# EAGLE design as5600 (EAGLE 9.6.2)
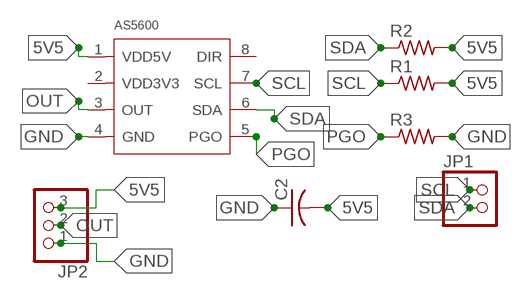
[diagram p0: schematic, sheet 1]

## Parts
AS5600  AS5600AS5600  [AS5600]
C2  C-USC0603  [C0603]
JP1  PINHD-1X2  [1X02]
JP2  PINHD-1X3  [1X03]
R1  R-US_R0603  [R0603]
R2  R-US_R0603  [R0603]
R3  R-US_R0603  [R0603]

## Nets
5V5: AS5600.1(VDD5V) C2.2 JP2.3 R1.2 R2.2
GND: AS5600.4(GND) C2.1 JP2.1 R3.2
OUT: AS5600.3(OUT) JP2.2
PGO: AS5600.5(PGO) R3.1
SCL: AS5600.7(SCL) JP1.1 R1.1
SDA: AS5600.6(SDA) JP1.2 R2.1
Unconnected: AS5600.2(VDD3V3) AS5600.8(DIR)

## Library data of the parts
AS5600 = AS5600:AS5600: AS5600 12-Bit Programmable Contactless Potentiometer Check availability <https://pricing.snapeda.com/parts/AS5600/Ams%20AG/view-part?ref=eda>; AVAILABILITY: In Stock; DESCRIPTION: Hall Effect Sensor Rotary Position External Magnet, Not Included Gull Wing; MF: Ams AG; MP: AS5600; PACKAGE: None; PRICE: None; PURCHASE-URL: https://pricing.snapeda.com/search/part/AS5600/?ref=eda
C2 = rcl:C-US: CAPACITOR, American symbol; SPICEPREFIX: C
JP1 = pinhead:PINHD-1X2: PIN HEADER
JP2 = pinhead:PINHD-1X3: PIN HEADER
R1-R3 = rcl:R-US_: RESISTOR, American symbol; SPICEPREFIX: R

## Board
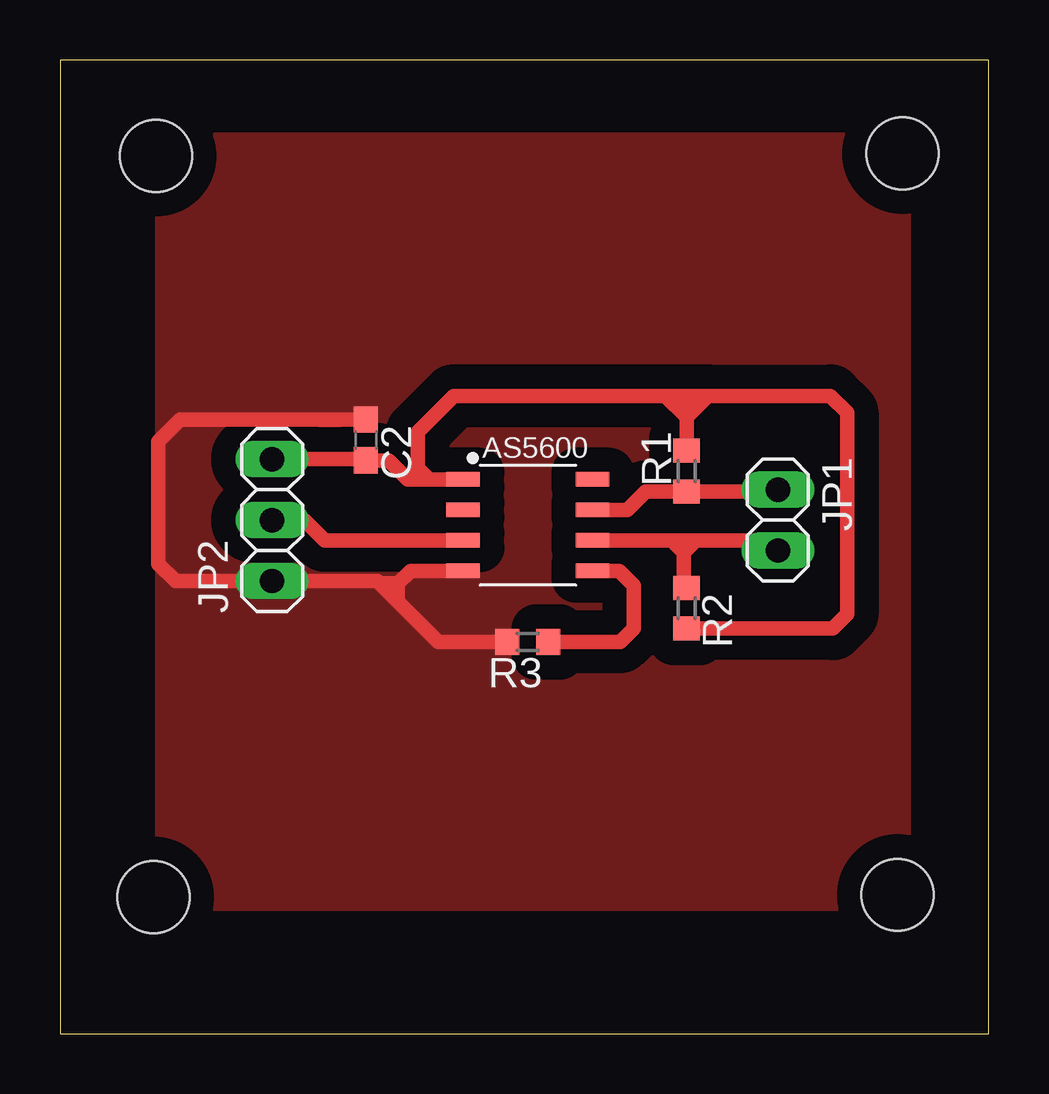
[diagram p1: board, top side]

Size 38.7 x 40.6 mm. Coordinates in mm from the lower left corner, seen from the top.
Outline: 0,0 38.7,0 38.7,40.6 0,40.6 0,0
Copper layers (1*16): Top 0.035mm / dielectric 1.5mm / Bottom 0.035mm
Design rules "default": minimum track width 6mil, minimum drill 0.35mm, track to track 6mil, track to pad 6mil, pad to pad 6mil, via to via 6mil, smd to smd 6mil, copper to edge 40mil, drill to drill 6mil, minimum pad ring 10mil, minimum via ring 8mil, stop-mask expansion 4mil, vias tented up to drill 0mil, thermal gap 10mil
Holes 3 mm at 4,36.6 35.1,36.7 34.9,5.8 3.9,5.7

### Footprints (pad centres in the part's own frame; a part is rotated, then mirrored left to right if it is on the bottom)
AS5600 = smd 0.6 x 1.4: 1 -1.905,-2.7; 2 -0.635,-2.7; 3 0.635,-2.7; 4 1.905,-2.7; 5 1.905,2.7; 6 0.635,2.7; 7 -0.635,2.7; 8 -1.905,2.7
C0603 = smd 1.1 x 1: 1 -0.85,0; 2 0.85,0
1X02 = drill 1.016 long: 1 -1.27,0; 2 1.27,0
1X03 = drill 1.016 long: 1 -2.54,0; 2 0,0; 3 2.54,0
R0603 = smd 1 x 1.1: 1 -0.85,0; 2 0.85,0

### Placement (x,y rotation side)
AS5600  19.49,21.21 270 top
C2  12.74,24.76 270 top
JP1  29.91,21.42 270 top
JP2  8.84,21.42 90 top
R1  26.11,23.46 90 top
R2  26.11,17.75 270 top
R3  19.49,16.34 180 top

### Tracks (layer width: path | path; a pad name or v marks a point on that pad's centre or on a via)
5V5
  Top 0.6: JP2.3 12.69,23.96 C2.2 13.7,23.91 14.49,23.12 | AS5600.1 15.38,23.12 | 15.38,23.12 14.9,23.12 | 14.9,23.12 14.49,23.12 | R1.2 26.11,25.71 | 26.11,25.71 27,26.6 | 27,26.6 32.1,26.6 32.8,25.9 32.8,17.5 32.2,16.9 R2.2 | 27,26.6 26.1,26.6 | 26.1,26.6 25.22,26.6 | 14.9,23.6 14.9,25.1 16.4,26.6 25.2,26.6 25.22,26.6 | 14.9,23.6 14.9,23.12 | 15.38,23.12 14.9,23.6 | 14.49,23.12 14.49,23.2 14.9,23.6 | 26.11,25.71 26.11,26.59 26.1,26.6 | 25.22,26.6 26.11,25.71
GND
  Top 0.6: 13.32,18.78 14.08,18.78 | AS5600.4 14.6,19.3 14.08,18.78 | C2.1 5.01,25.61 4.1,24.7 4.1,19.6 4.82,18.88 JP2.1 13.22,18.88 13.32,18.78 | R3.2 15.76,16.34 14.08,18.02 | 14.08,18.02 13.32,18.78 | 14.08,18.02 14.08,18.78
  pour Top (isolate 1.016, no thermals): 4,34.7 4,7.7 arc-90 6.1,5.6 6.1,5.2 32.8,5.2 arc-90 35.2,7.6 35.4,7.6 35.4,34.7 arc-90 33,37.1 33,37.5 6.4,37.5 6.4,37.1 arc-90
OUT
  Top 0.6: AS5600.3 11.02,20.58 10.18,21.42 JP2.2
PGO
  Top 0.6: AS5600.5 23.29,19.3 23.9,18.7 23.9,16.9 23.34,16.34 R3.1
SCL
  Top 0.6: AS5600.7 23.65,21.85 24.41,22.61 25.6,22.61 R1.1 29.83,22.61 JP1.1
SDA
  Top 0.6: AS5600.6 25.5,20.58 | 25.5,20.58 26,20.58 | 26,20.58 26.5,20.58 | 26.5,20.58 29.48,20.58 JP1.2 | R2.1 26,18.71 26,20.08 | 26,20.08 26,20.58 | 25.5,20.58 26,20.08 | 26,20.08 26.5,20.58